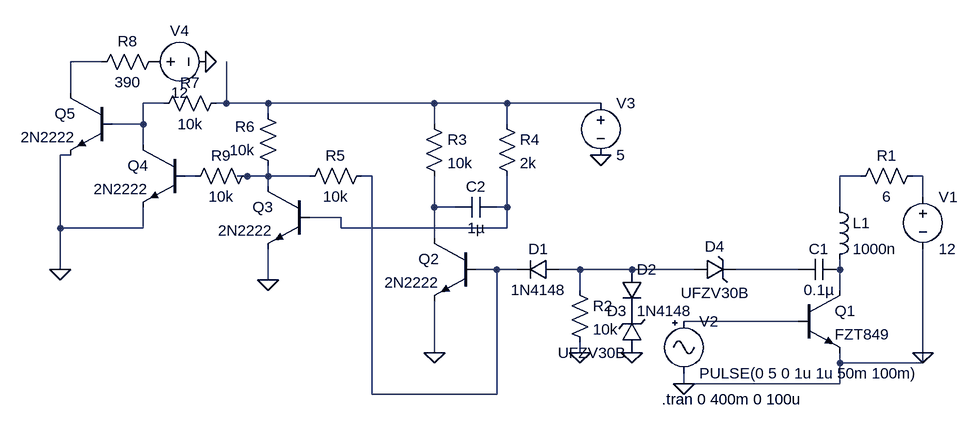
[diagram p0: schematic IGF_Circuit.asc]
IGF_Circuit.asc, the LTspice schematic file:
Version 4
SHEET 1 880 680
WIRE -864 -112 -912 -112
WIRE -912 -64 -912 -112
WIRE -768 -48 -800 -48
WIRE -672 -48 -672 -112
WIRE -672 -48 -688 -48
WIRE -608 -48 -672 -48
WIRE -352 -48 -608 -48
WIRE -240 -48 -352 -48
WIRE -96 -48 -240 -48
WIRE -608 -32 -608 -48
WIRE -800 -16 -800 -48
WIRE -800 -16 -848 -16
WIRE -352 -16 -352 -48
WIRE -240 -16 -240 -48
WIRE -800 16 -800 -16
WIRE -912 32 -928 32
WIRE -720 64 -736 64
WIRE -640 64 -656 64
WIRE -608 64 -608 48
WIRE -608 64 -640 64
WIRE -544 64 -608 64
WIRE -448 64 -464 64
WIRE 304 64 272 64
WIRE 400 64 384 64
WIRE -608 80 -608 64
WIRE 400 96 400 64
WIRE -352 112 -352 64
WIRE -320 112 -352 112
WIRE -240 112 -240 64
WIRE -240 112 -256 112
WIRE 272 112 272 64
WIRE -496 128 -544 128
WIRE -928 144 -928 32
WIRE -800 144 -800 112
WIRE -800 144 -928 144
WIRE -496 144 -496 128
WIRE -240 144 -240 112
WIRE -240 144 -496 144
WIRE -352 160 -352 112
WIRE -928 208 -928 144
WIRE -256 208 -288 208
WIRE -224 208 -256 208
WIRE -128 208 -160 208
WIRE -48 208 -128 208
WIRE 48 208 -48 208
WIRE 208 208 112 208
WIRE 272 208 272 192
WIRE -608 224 -608 176
WIRE -128 240 -128 208
WIRE 272 240 272 208
WIRE 208 288 32 288
WIRE -352 336 -352 256
WIRE -128 336 -128 320
WIRE 400 336 400 176
WIRE 272 352 272 336
WIRE 400 352 400 336
WIRE 400 352 272 352
WIRE 32 384 32 368
WIRE 272 384 272 352
WIRE 272 384 32 384
WIRE -448 400 -448 64
WIRE -256 400 -256 208
WIRE -256 400 -448 400
FLAG 32 384 0
FLAG 400 336 0
FLAG -128 336 0
FLAG -352 336 0
FLAG -96 32 0
FLAG -608 224 0
FLAG -928 208 0
FLAG -48 336 0
FLAG -704 -112 0
SYMBOL ind 256 96 R0
SYMATTR InstName L1
SYMATTR Value 1000n
SYMATTR SpiceLine Ipk=0.175 Rser=3.2 Rpar=25425.4 Cpar=0 mfg="Coilcraft" pn="0805CS-102"
SYMBOL voltage 400 80 R0
WINDOW 123 0 0 Left 0
WINDOW 39 0 0 Left 0
SYMATTR InstName V1
SYMATTR Value 12
SYMBOL npn 208 240 R0
SYMATTR InstName Q1
SYMATTR Value FZT849
SYMBOL Misc\\signal 32 272 R0
WINDOW 123 0 0 Left 0
WINDOW 39 0 0 Left 0
SYMATTR InstName V2
SYMATTR Value PULSE(0 5 0 1u 1u 50m 100m)
SYMBOL res 400 48 R90
WINDOW 0 0 56 VBottom 2
WINDOW 3 32 56 VTop 2
SYMATTR InstName R1
SYMATTR Value 6
SYMBOL cap 272 192 R90
WINDOW 0 0 32 VBottom 2
WINDOW 3 32 32 VTop 2
SYMATTR InstName C1
SYMATTR Value 0.1µ
SYMATTR SpiceLine V=1K Irms=0 Rser=0.0165 Lser=1000p mfg="Würth Elektronik" pn="885342214173 WCAP-CSMH 2220" type="X7R"
SYMBOL res -144 224 R0
SYMATTR InstName R2
SYMATTR Value 10k
SYMBOL diode -160 192 R90
WINDOW 0 0 32 VBottom 2
WINDOW 3 32 32 VTop 2
SYMATTR InstName D1
SYMATTR Value 1N4148
SYMBOL npn -288 160 M0
SYMATTR InstName Q2
SYMATTR Value 2N2222
SYMBOL cap -256 96 R90
WINDOW 0 0 32 VBottom 2
WINDOW 3 32 32 VTop 2
SYMATTR InstName C2
SYMATTR Value 1µ
SYMATTR SpiceLine V=10 Irms=2.59 Rser=0.0171188 Lser=0 mfg="KEMET" pn="C0603C105K8RAC" type="X7R"
SYMBOL res -368 -32 R0
SYMATTR InstName R3
SYMATTR Value 10k
SYMBOL res -256 -32 R0
SYMATTR InstName R4
SYMATTR Value 2k
SYMBOL npn -544 80 M0
SYMATTR InstName Q3
SYMATTR Value 2N2222
SYMBOL res -448 48 R90
WINDOW 0 0 56 VBottom 2
WINDOW 3 32 56 VTop 2
SYMATTR InstName R5
SYMATTR Value 10k
SYMBOL res -592 64 R180
WINDOW 0 36 76 Left 2
WINDOW 3 36 40 Left 2
SYMATTR InstName R6
SYMATTR Value 10k
SYMBOL voltage -96 -64 R0
WINDOW 123 0 0 Left 0
WINDOW 39 0 0 Left 0
SYMATTR InstName V3
SYMATTR Value 5
SYMBOL npn -736 16 M0
SYMATTR InstName Q4
SYMATTR Value 2N2222
SYMBOL res -672 -64 R90
WINDOW 0 0 56 VBottom 2
WINDOW 3 32 56 VTop 2
SYMATTR InstName R7
SYMATTR Value 10k
SYMBOL npn -848 -64 M0
SYMATTR InstName Q5
SYMATTR Value 2N2222
SYMBOL res -768 -128 R90
WINDOW 0 0 56 VBottom 2
WINDOW 3 32 56 VTop 2
SYMATTR InstName R8
SYMATTR Value 390
SYMBOL res -624 48 R90
WINDOW 0 0 56 VBottom 2
WINDOW 3 32 56 VTop 2
SYMATTR InstName R9
SYMATTR Value 10k
SYMBOL diode -64 208 R0
SYMATTR InstName D2
SYMATTR Value 1N4148
SYMBOL zener -32 336 R180
WINDOW 0 24 64 Left 2
WINDOW 3 24 0 Left 2
SYMATTR InstName D3
SYMATTR Value UFZV30B
SYMATTR Description Diode
SYMATTR Type diode
SYMBOL voltage -800 -112 R270
WINDOW 0 32 56 VTop 2
WINDOW 3 -32 56 VBottom 2
WINDOW 123 0 0 Left 0
WINDOW 39 0 0 Left 0
SYMATTR InstName V4
SYMATTR Value 12
SYMBOL zener 48 224 R270
WINDOW 0 36 32 VTop 2
WINDOW 3 -4 32 VBottom 2
SYMATTR InstName D4
SYMATTR Value UFZV30B
SYMATTR Description Diode
SYMATTR Type diode
TEXT -2 408 Left 2 !.tran 0 400m 0 100u

The netlist it stands for:
* IGF_Circuit.asc
L1 N007 N013 1000n Ipk=0.175 Rser=3.2 Rpar=25425.4 Cpar=0 mfg="Coilcraft" pn="0805CS-102"
V1 N008 0 12
Q1 N013 N014 0 0 FZT849
V2 N014 0 PULSE(0 5 0 1u 1u 50m 100m)
R1 N008 N007 6
C1 N013 N012 0.1µ V=1K Irms=0 Rser=0.0165 Lser=1000p mfg="Würth Elektronik" pn="885342214173 WCAP-CSMH 2220" type="X7R"
R2 N011 0 10k
D1 N011 N006 1N4148
Q2 N009 N006 0 0 2N2222
C2 N010 N009 1µ V=10 Irms=2.59 Rser=0.0171188 Lser=0 mfg="KEMET" pn="C0603C105K8RAC" type="X7R"
R3 N003 N009 10k
R4 N003 N010 2k
Q3 N005 N010 0 0 2N2222
R5 N006 N005 10k
R6 N005 N003 10k
V3 N003 0 5
Q4 N002 N004 0 0 2N2222
R7 N003 N002 10k
Q5 N001 N002 0 0 2N2222
R8 P001 N001 390
R9 N005 N004 10k
D2 N011 P002 1N4148
D3 0 P002 UFZV30B
V4 P001 0 12
D4 N011 N012 UFZV30B
.model D D
.lib standard.dio
.model NPN NPN
.model PNP PNP
.lib standard.bjt
.tran 0 400m 0 100u
.backanno
.end